# EAGLE design sensorboard (EAGLE 9.6.2)

## Sheet 1 of 2
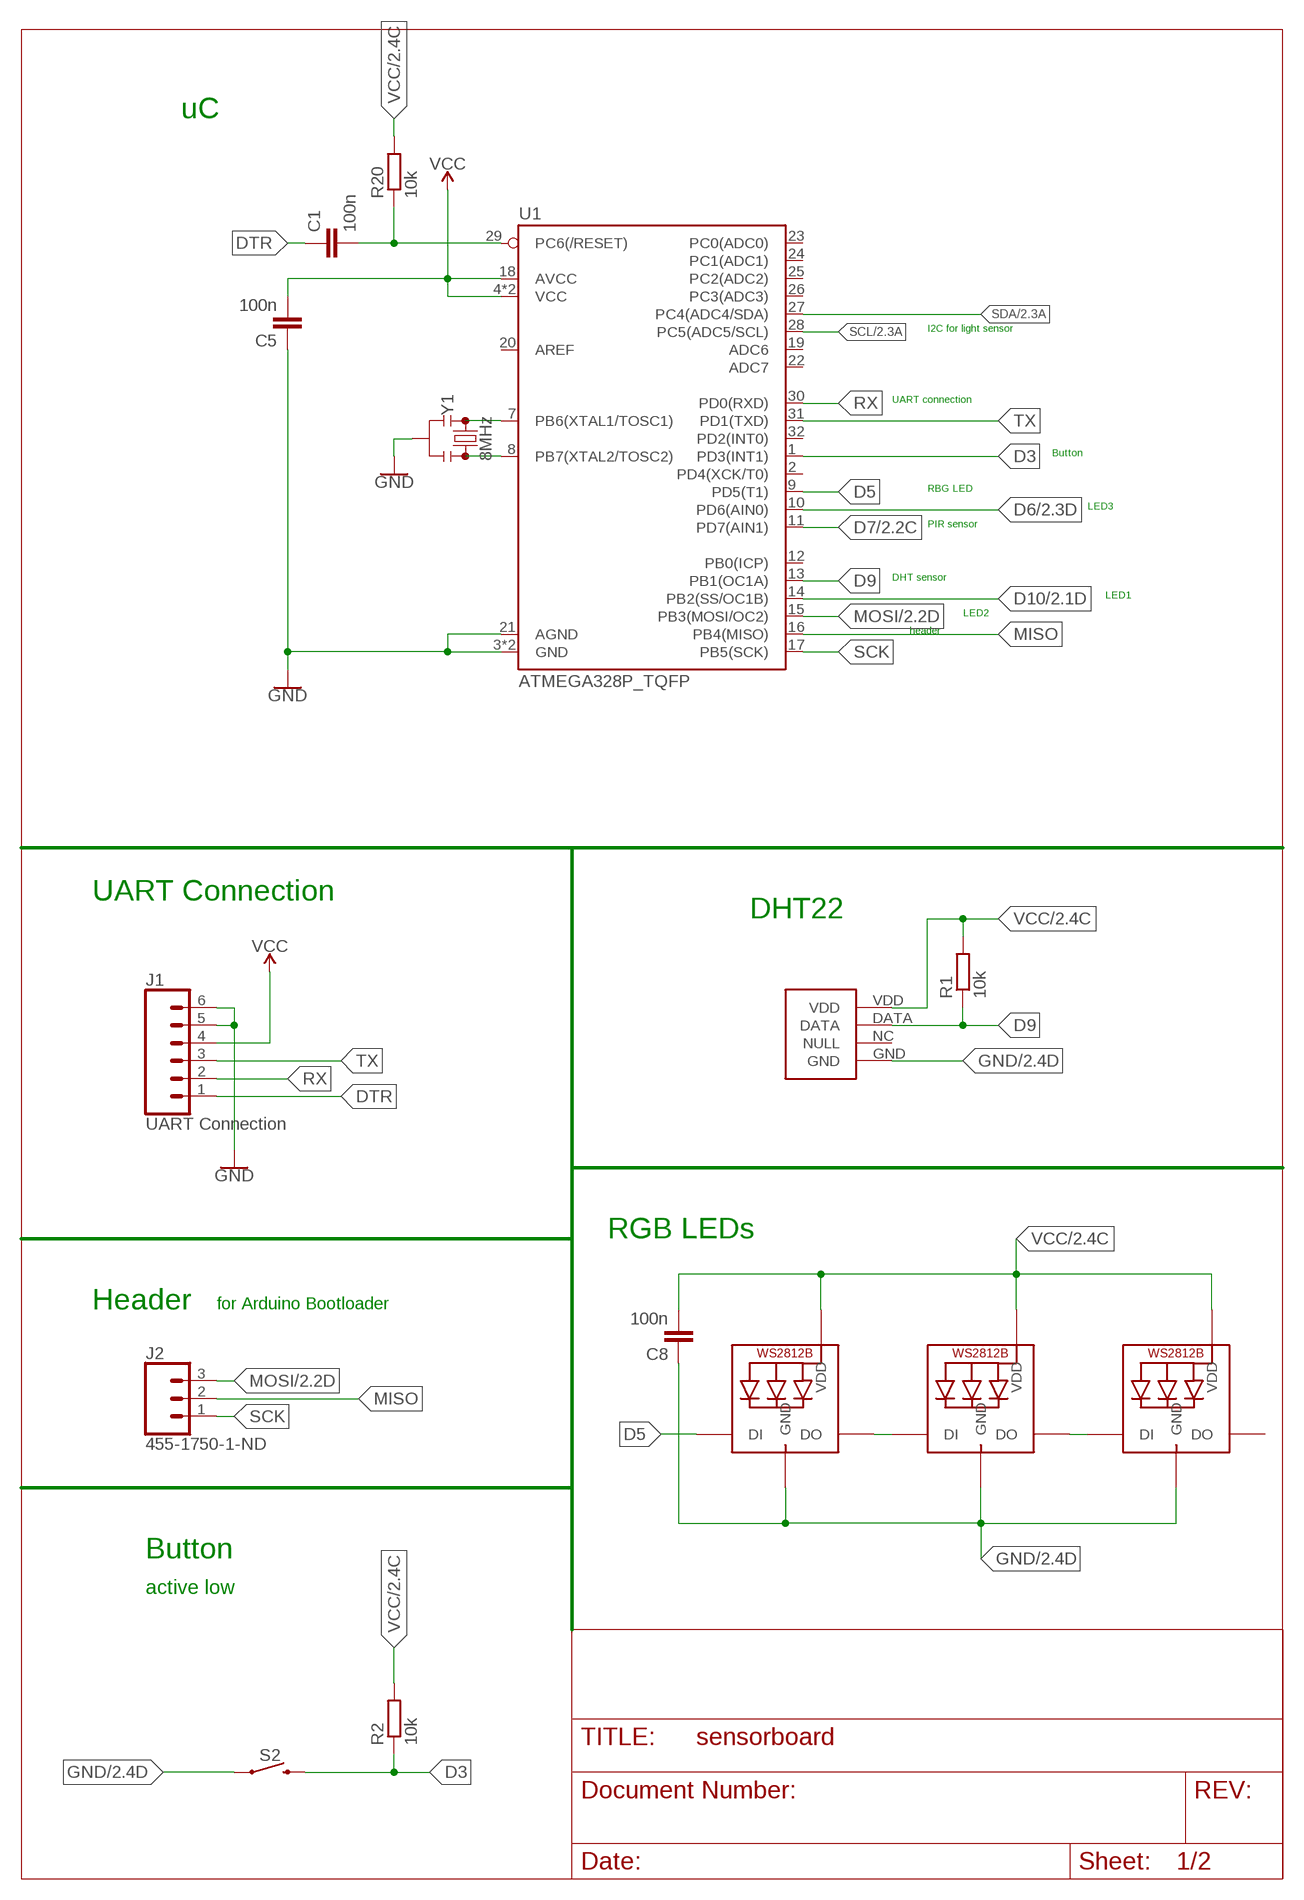
[diagram p0: schematic, sheet 1]

### Parts
C1  100n  C-EUC0402  [C0402]
C5  100n  C-EUC0402  [C0402]
C8  100n  C-EUC0402  [C0402]
DHT22  DHT22  [DHT22]
J1  UART Connection  CONN_06SILK_FEMALE_PTH  [1X06]
J2  455-1750-1-ND  CONN_03  [1X03]
LED1  WS2812B5050  [WS2812B]
LED2  WS2812B5050  [WS2812B]
LED3  WS2812B5050  [WS2812B]
R1  10k  R-EU_R0402  [R0402]
R2  10k  R-EU_R0402  [R0402]
R20  10k  R-EU_R0402  [R0402]
S2  MOMENTARY-SWITCH-SPST-SMD-6.0X3.5MM  [TACTILE_SWITCH_SMD_6.0X3.5MM]
U1  ATMEGA328P_TQFP  [TQFP32-08]
Y1  8MHz  RESONATOR-8MHZSMD_3.2X1.3  [RESONATOR-SMD-3.2X1.3]

### Nets
D3: R2.1 S2.2 U1.1(PD3(INT1))
D5: LED2.4-DIN(DI) U1.9(PD5(T1))
D6: U1.10(PD6(AIN0)) ; also sheet 2
D7: U1.11(PD7(AIN1)) ; also sheet 2
D9: DHT22.DATA R1.1 U1.13(PB1(OC1A))
D10: U1.14(PB2(SS/OC1B)) ; also sheet 2
DTR: C1.1 J1.1
GND: C5.1 C8.1 DHT22.GND J1.5 J1.6 LED1.3-GND(GND) LED2.3-GND(GND) LED3.3-GND(GND) S2.1 U1.3(GND) U1.5(GND) U1.21(AGND) Y1.2 ; also sheet 2
MISO: J2.2 U1.16(PB4(MISO))
MOSI: J2.3 U1.15(PB3(MOSI/OC2)) ; also sheet 2
N$1: U1.7(PB6(XTAL1/TOSC1)) Y1.1
N$2: U1.8(PB7(XTAL2/TOSC2)) Y1.3
N$4: LED1.4-DIN(DI) LED2.2-DOUT(DO)
N$9: LED1.2-DOUT(DO) LED3.4-DIN(DI)
N$10: C1.2 R20.1 U1.29(PC6(/RESET))
RX: J1.2 U1.30(PD0(RXD))
SCK: J2.1 U1.17(PB5(SCK))
SCL: U1.28(PC5(ADC5/SCL)) ; also sheet 2
SDA: U1.27(PC4(ADC4/SDA)) ; also sheet 2
TX: J1.3 U1.31(PD1(TXD))
VCC: C5.2 C8.2 DHT22.VDD J1.4 LED1.1-VDD(VDD) LED2.1-VDD(VDD) LED3.1-VDD(VDD) R1.2 R2.2 R20.2 U1.4(VCC) U1.6(VCC) U1.18(AVCC) ; also sheet 2
Unconnected: DHT22.NC(NULL) LED3.2-DOUT(DO) U1.2(PD4(XCK/T0)) U1.12(PB0(ICP)) U1.19(ADC6) U1.20(AREF) U1.22(ADC7) U1.23(PC0(ADC0)) U1.24(PC1(ADC1)) U1.25(PC2(ADC2)) U1.26(PC3(ADC3)) U1.32(PD2(INT0))

### Notes on the sheet
- uC
- I2C for light sensor
- UART connection
- Button
- RBG LED
- LED3
- PIR sensor
- DHT sensor
- LED1
- LED2
- header
- UART Connection
- DHT22
- RGB LEDs
- Header | for Arduino Bootloader
- Button
- active low

## Sheet 2 of 2
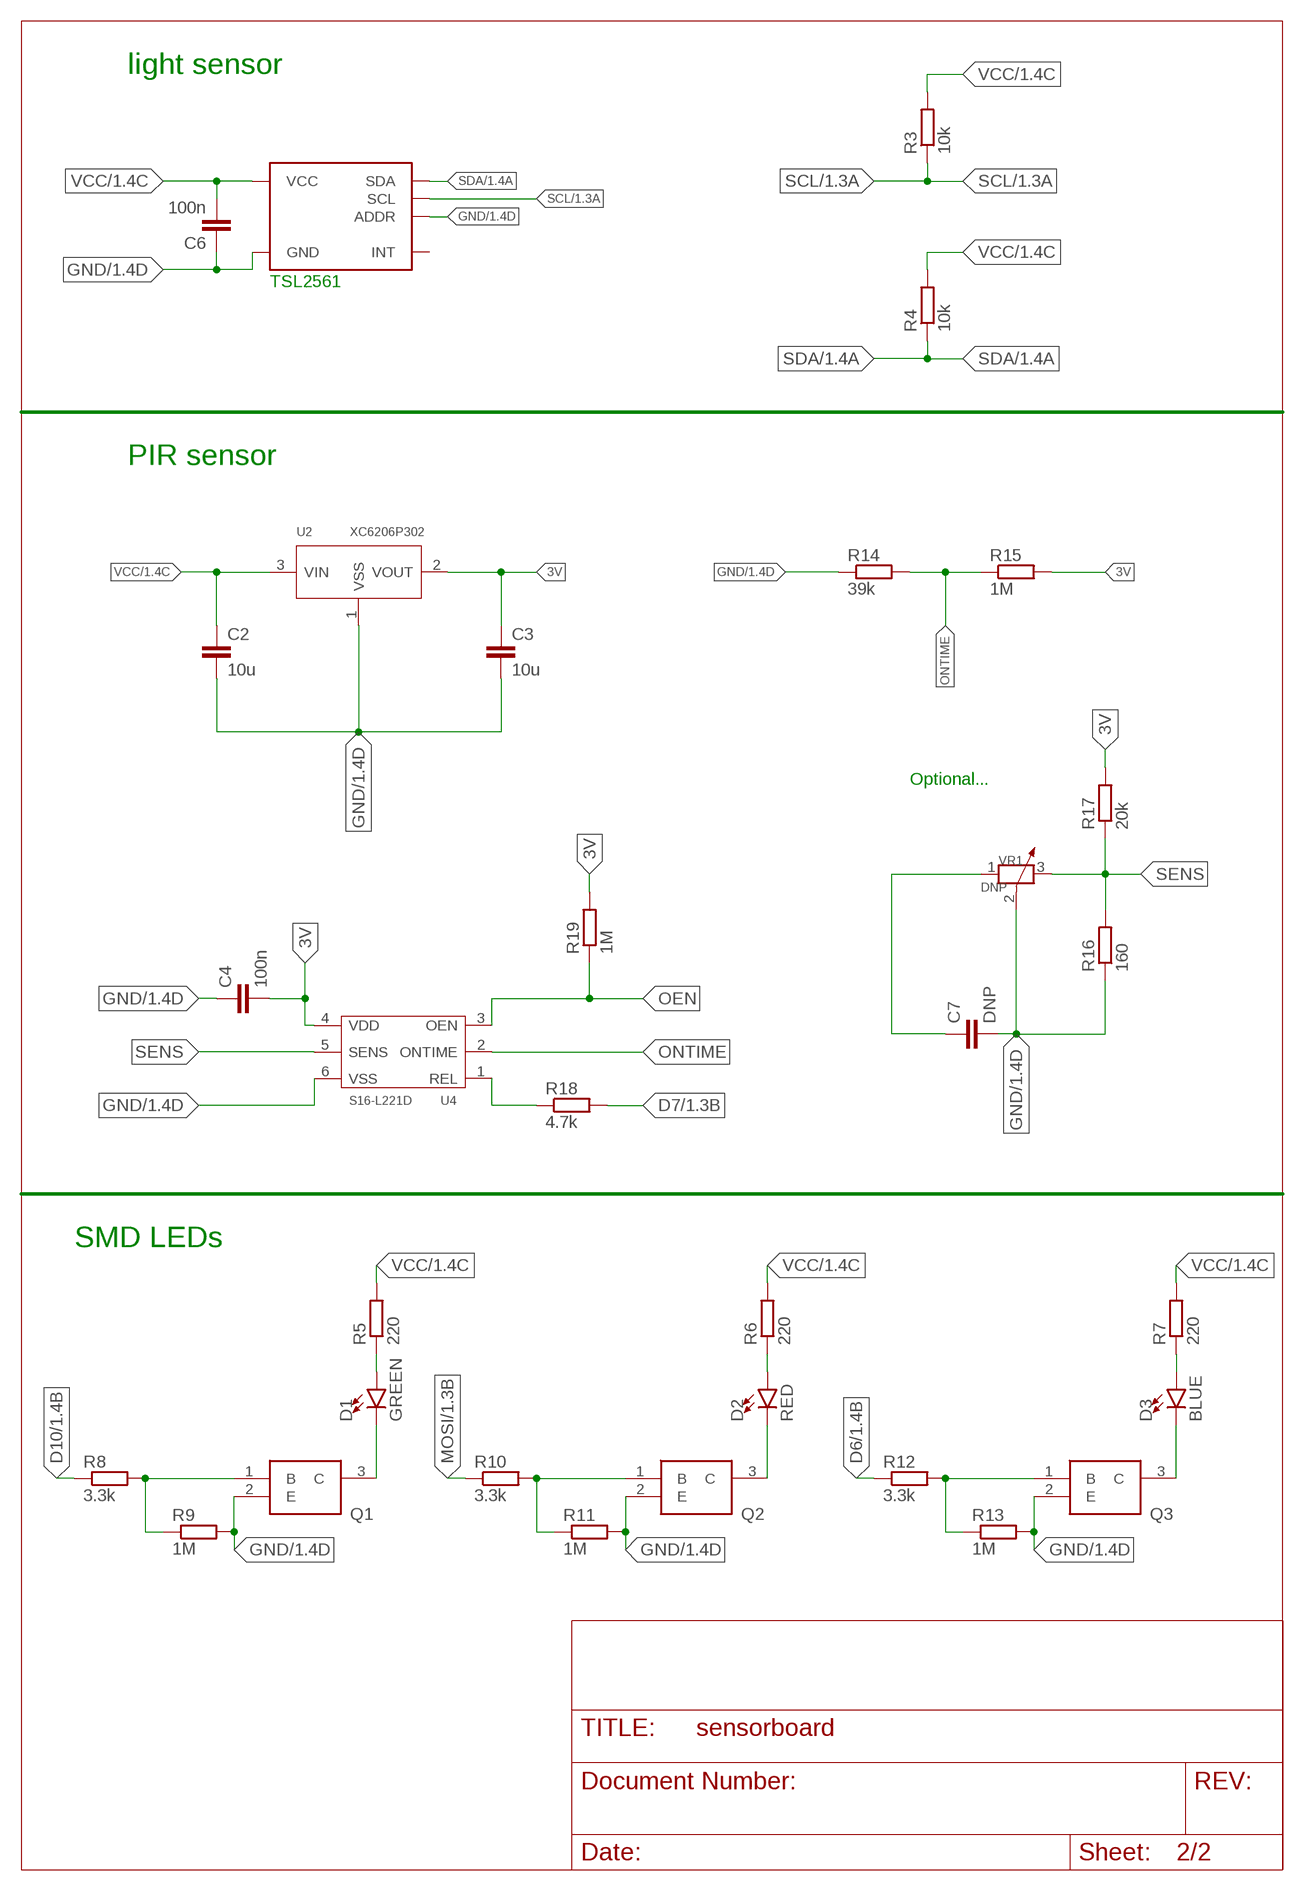
[diagram p1: schematic, sheet 2]

### Parts
C2  10u  C-EUC0402  [C0402]
C3  10u  C-EUC0402  [C0402]
C4  100n  C-EUC0402  [C0402]
C6  100n  C-EUC0402  [C0402]
C7  DNP  C-EUC0402  [C0402]
D1  GREEN  LED-GREEN0603  [LED-0603]
D2  RED  LED-RED0603  [LED-0603]
D3  BLUE  LED-BLUE0603  [LED-0603]
Q1  MMSS8050-L-TP  [SOT96P237X122-3N]
Q2  MMSS8050-L-TP  [SOT96P237X122-3N]
Q3  MMSS8050-L-TP  [SOT96P237X122-3N]
R3  10k  R-EU_R0402  [R0402]
R4  10k  R-EU_R0402  [R0402]
R5  220  R-EU_R0402  [R0402]
R6  220  R-EU_R0402  [R0402]
R7  220  R-EU_R0402  [R0402]
R8  3.3k  R-EU_R0402  [R0402]
R9  1M  R-EU_R0402  [R0402]
R10  3.3k  R-EU_R0402  [R0402]
R11  1M  R-EU_R0402  [R0402]
R12  3.3k  R-EU_R0402  [R0402]
R13  1M  R-EU_R0402  [R0402]
R14  39k  R-EU_R0402  [R0402]
R15  1M  R-EU_R0402  [R0402]
R16  160  R-EU_R0402  [R0402]
R17  20k  R-EU_R0402  [R0402]
R18  4.7k  R-EU_R0402  [R0402]
R19  1M  R-EU_R0402  [R0402]
TSL2561  TSL2561FN  [DFN-6]
U2  XC6206P302  PMIC-XC6206PMR  [SOT-23]
U4  S16-L221D  [6P-SMD-6X6MM]
VR1  DNP  RES-ADJ'RTRIM3214W'  [ADJR3-SMD-4.6X3.7MM]

### Nets
3V: C3.1 C4.2 R15.2 R17.2 R19.2 U2.2(VOUT) U4.4(VDD)
D6: R12.1 ; also sheet 1
D7: R18.2 ; also sheet 1
D10: R8.1 ; also sheet 1
GND: C2.2 C3.2 C4.1 C6.1 C7.2 Q1.2(E) Q2.2(E) Q3.2(E) R9.2 R11.2 R13.2 R14.1 R16.1 TSL2561.ADDR TSL2561.GND U2.1(VSS) U4.6(VSS) VR1.2 ; also sheet 1
MOSI: R10.1 ; also sheet 1
N$3: R18.1 U4.1(REL)
N$7: C7.1 VR1.1
N$8: D1.C Q1.3(C)
N$11: Q1.1(B) R8.2 R9.1
N$12: Q2.1(B) R10.2 R11.1
N$14: Q3.1(B) R12.2 R13.1
N$17: D1.A R5.1
N$22: D2.C Q2.3(C)
N$23: D2.A R6.1
N$25: D3.A R7.1
N$26: D3.C Q3.3(C)
OEN: R19.1 U4.3(OEN)
ONTIME: R14.2 R15.1 U4.2(ONTIME)
SCL: R3.1 TSL2561.SCL ; also sheet 1
SDA: R4.1 TSL2561.SDA ; also sheet 1
SENS: R16.2 R17.1 U4.5(SENS) VR1.3
VCC: C2.1 C6.2 R3.2 R4.2 R5.2 R6.2 R7.2 TSL2561.VDD(VCC) U2.3(VIN) ; also sheet 1
Unconnected: TSL2561.INT

### Notes on the sheet
- light sensor
- TSL2561
- PIR sensor
- Optional...
- SMD LEDs

## Library data of the parts
C1-C8 = rcl:C-EU: CAPACITOR, European symbol; SPICEPREFIX: C
D1 = SparkFun-LED:LED-GREEN: Green SMD LED Used in manufacturing of various products at SparkFun Packages: 0603 - SMD 0603 package [Product Link] <http://www.futureelectronics.com/en/technologies/semiconductors/optoelectronics/leds/Pages/9894312-LTST-C190GKT.aspx?CrossPart=HSMG-C190&IM=0> LilyPad 1206 - SMD1206 LilyPad package [Product Link] <http://www.futureelectronics.com/en/Technologies/Product.aspx?ProductID=IN150NGHARVATEKCORPORATION2049943&IM=0> 1206 - SMD1206 package [Product Link] <http://www.futureelectronics.com/en/technologies/semiconductors/optoelectronics/leds/Pages/8315665-LTST-C150KGKT.aspx?IM=0> 1206 Bottom Mount -SMD 1206 Bottom Mount [Product Link] <http://www.digikey.com/product-detail/en/lite-on-inc/LTST-C230KGKT/160-1456-1-ND/386854> SparkFun Products: Pro Mini 328 -5V <https://www.sparkfun.com/products/821> RedBoard <https://www.sparkfun.com/products/12757> MP3 Trigger <https://www.sparkfun.com/products/13720> Makey Makey <https://www.sparkfun.com/products/11076>; PROD_ID: DIO-00821
D2 = SparkFun-LED:LED-RED: Red SMD LED Used in manufacturing of most products at SparkFun Packages: 0603 - SMD 0603 package [Product Link] <http://docs.avagotech.com/docs/AV02-0551EN> 0603 SMART - SMD 0603 SMART package ( more efficient and expensive)[Product Link] <http://www.osram-os.com/Graphics/XPic2/00077099_0.pdf> 1206 - SMD1206 package [Product Link] <https://www.sparkfun.com/datasheets/DevTools/LilyPad/Q150OVS4.pdff> SparkFun Products: Pro Mini 328 -5V <https://www.sparkfun.com/products/821> RedBoard <https://www.sparkfun.com/products/12757> IOIO-OTG <https://www.sparkfun.com/products/13613>; PROD_ID: DIO-00819
D3 = SparkFun-LED:LED-BLUE: Blue SMD LED Used in manufacturing of various products at SparkFun Packages: 0603 - SMD 0603 package [Product Link] <http://www.digikey.com/product-detail/en/SMLE12BC7TT86/511-1589-2-ND/1641808> 1206 - SMD1206 package [Product Link] <http://www.digikey.com/product-detail/en/lite-on-inc/LTST-C150TBKT/160-1643-1-ND/573584> SparkFun Products: ESP8266 Thing-Dev Board <https://www.sparkfun.com/products/13711> RedBoard <https://www.sparkfun.com/products/12757>; PROD_ID: DIO-08575
DHT22 = DHT22:DHT22
J1 = SparkFun-Connectors:CONN_06: Multi connection point. Often used as Generic Header-pin footprint for 0.1 inch spaced/style header connections On any of the 0.1 inch spaced packages, you can populate with these: Break Away Headers - Straight <https://www.sparkfun.com/products/116> (PRT-00116) Break Away Male Headers - Right Angle <https://www.sparkfun.com/products/553> (PRT-00553) Female Headers <https://www.sparkfun.com/products/115> (PRT-00115) Break Away Headers - Machine Pin <https://www.sparkfun.com/products/117> (PRT-00117) Break Away Female Headers - Swiss Machine Pin <https://www.sparkfun.com/products/743> (PRT-00743) Arduino Stackable Header - 6 Pin <https://www.sparkfun.com/products/9280> (PRT-09280) For SCREWTERMINALS and SPRING TERMINALS visit here: Screw Terimnals on SparkFun.com <https://www.sparkfun.com/search/results?term=Screw+Terminals> (5mm/3.5mm/2.54mm spacing) This device is also useful as a general connection point to wire up your design to another part of your project. Our various solder wires solder well into these plated through hole pads. Hook-Up Wire - Assortment (Stranded, 22 AWG) <https://www.sparkfun.com/products/11375> (PRT-11375) Hook-Up Wire - Assortment (Solid Core, 22 AWG) <https://www.sparkfun.com/products/11367> (PRT-11367) View the entire wire category on our website here <https://www.sparkfun.com/categories/141>; PROD_ID: CONN-08437
J2 = SparkFun-Connectors:CONN_03: Multi connection point. Often used as Generic Header-pin footprint for 0.1 inch spaced/style header connections On any of the 0.1 inch spaced packages, you can populate with these: Break Away Headers - Straight <https://www.sparkfun.com/products/116> (PRT-00116) Break Away Male Headers - Right Angle <https://www.sparkfun.com/products/553> (PRT-00553) Female Headers <https://www.sparkfun.com/products/115> (PRT-00115) Break Away Headers - Machine Pin <https://www.sparkfun.com/products/117> (PRT-00117) Break Away Female Headers - Swiss Machine Pin <https://www.sparkfun.com/products/743> (PRT-00743) Stackable Header - 3 Pin (Female, 0.1") <https://www.sparkfun.com/products/13875> (PRT-13875) For SCREWTERMINALS and SPRING TERMINALS visit here: Screw Terimnals on SparkFun.com <https://www.sparkfun.com/search/results?term=Screw+Terminals> (5mm/3.5mm/2.54mm spacing) This device is also useful as a general connection point to wire up your design to another part of your project. Our various solder wires solder well into these plated through hole pads. Hook-Up Wire - Assortment (Stranded, 22 AWG) <https://www.sparkfun.com/products/11375> (PRT-11375) Hook-Up Wire - Assortment (Solid Core, 22 AWG) <https://www.sparkfun.com/products/11367> (PRT-11367) View the entire wire category on our website here <https://www.sparkfun.com/categories/141> Special notes: Molex polarized connector foot print use with SKU : PRT-08232 with associated crimp pins and housings.; PROD_ID: XXX-00000
LED1-LED3 = WS2812B:WS2812B; AVAILABILITY: Unavailable; DESCRIPTION: Raspberry Pi HAT (40 pin) Wheeled Robotics Kit; MF: Seeed Technology; MP: WS2812B; PACKAGE: None; PRICE: None
Q1-Q3 = SamacSys_Parts:MMSS8050-L-TP: Bipolar Transistors - BJT 625mW, 25V, 1500mA Source: Datasheet <https://componentsearchengine.com/Datasheets/1/MMSS8050-L-TP.pdf>; DESCRIPTION: Bipolar Transistors - BJT 625mW, 25V, 1500mA; HEIGHT: 1.22mm; MANUFACTURER_NAME: Micro Commercial Components (MCC); MANUFACTURER_PART_NUMBER: MMSS8050-L-TP; MOUSER_PART_NUMBER: 833-MMSS8050-L-TP; MOUSER_PRICE-STOCK: https://www.mouser.co.uk/ProductDetail/Micro-Commercial-Components-MCC/MMSS8050-L-TP?qs=FaVZESsvgnebflbaqJWJVQ%3D%3D
R1-R20 = rcl:R-EU_: RESISTOR, European symbol; SPICEPREFIX: R
S2 = SparkFun-Switches:MOMENTARY-SWITCH-SPST: Momentary Switch (Pushbutton) - SPST Normally-open (NO) SPST momentary switches (buttons, pushbuttons). Variants PTH-12MM - 12mm square, through-hole Momentary Pushbutton Switch - 12mm Square <https://www.sparkfun.com/products/9190> (COM-09190) PTH-6.0MM, PTH-6.0MM-KIT - 6.0mm square, through-hole Mini Pushbutton Switch <https://www.sparkfun.com/products/97> (COM-00097) KIT package intended for soldering kit's - only one side of pads' copper is exposed. PTH-RIGHT-ANGLE-KIT - Right-angle, through-hole Right Angle Tactile Button <https://www.sparkfun.com/products/10791> - Used on SparkFun BigTime Watch Kit <https://www.sparkfun.com/products/11734> SMD-12MM - 12mm square, surface-mount Tactile Button - SMD (12mm) <https://www.sparkfun.com/products/12993> (COM-12993) Used on SparkFun PicoBoard <https://www.sparkfun.com/products/11888> SMD-4.5MM - 4.5mm Square Trackball Switch Used on SparkFun Blackberry Trackballer Breakout <https://www.sparkfun.com/products/13169> SMD-4.6MMX2.8MM - 4.60mm x 2.80mm, surface mount Used on SparkFun SAMD21 Mini Breakout <https://www.sparkfun.com/products/13664> SMD-5.2MM, SMD-5.2-REDUNDANT - 5.2mm square, surface-mount Mini Pushbutton Switch - SMD <https://www.sparkfun.com/products/8720> (COM-08720) Used on Arduino Pro Mini <https://www.sparkfun.com/products/11114> REDUNDANT package connects both switch circuits together SMD-6.0X3.5MM - 6.0 x 3.5mm, surface mount Momentary Reset Switch SMD <https://www.sparkfun.com/products/8229> (COM-08229) SMD-6.2MM-TALL - 6.2mm square, surface mount Tactile Button - SMD (6mm) <https://www.sparkfun.com/products/12992> Used on SparkFun Digital Sandbox <https://www.sparkfun.com/products/12651> SMD-RIGHT-ANGLE - Right-angle, surface mount Used on SparkFun Block for Intel® Edison - Arduino <https://www.sparkfun.com/products/13036>; PROD_ID: SWCH-14278; SF_SKU: COM-08229
TSL2561 = TSL2561:TSL2561: Check prices <https://pricing.snapeda.com/parts/TSL2561/ams/view-part?ref=eda>; AVAILABILITY: Bad; DESCRIPTION: Optical Sensor Ambient 640nm I²C 6-SMD, No Lead; MF: ams; MP: TSL2561; PACKAGE: SMD-6 TAOS; PRICE: None
U1 = SparkFun-IC-Microcontroller:ATMEGA328P_TQFP: Popular 328P in QFP Storefront component: ATmega328 - TQFP <https://www.sparkfun.com/products/13448> (COM-13448) Datasheet <http://www.sparkfun.com/datasheets/Components/SMD/ATMega328.pdf> SparkFun Products SparkFun RedBoard - Programmed with Arduino <https://www.sparkfun.com/products/12757> (DEV-12757) Arduino Pro Mini 328 - 5V/16MHz <https://www.sparkfun.com/products/11113> (DEV-11113) Arduino Pro Mini 328 - 3.3V/8MHz <https://www.sparkfun.com/products/11114> (DEV-11114) SparkFun OpenLog <https://www.sparkfun.com/products/13712> (DEV-13712) SparkFun MicroView - OLED Arduino Module <https://www.sparkfun.com/products/12923> (DEV-12923) SparkFun Digital Sandbox <https://www.sparkfun.com/products/12651> (DEV-12651) SparkFun PicoBoard <https://www.sparkfun.com/products/11888> (WIG-11888) Arduino Fio <https://www.sparkfun.com/products/10116> (DEV-10116) LilyPad Arduino 328 Main Board <https://www.sparkfun.com/products/13342> (DEV-13342) SparkFun RedStick <https://www.sparkfun.com/products/13741> (DEV-13741) LilyPad MP3 <https://www.sparkfun.com/products/11013> (DEV-11013) LilyPad Arduino SimpleSnap <https://www.sparkfun.com/products/10941> (DEV-10941) SparkFun Stepoko <https://www.sparkfun.com/products/13899> (ROB-13899) SparkFun Geiger Counter <https://www.sparkfun.com/products/11345> (SEN-11345) SparkFun EL Sequencer <https://www.sparkfun.com/products/12781> (COM-12781) Arduino Pro 328 - 5V/16MHz <https://www.sparkfun.com/products/10915> (DEV-10915) CryptoCape <https://www.sparkfun.com/products/12773> (DEV-12773) SparkFun IR Thermometer Evaluation Board - MLX90614 <https://www.sparkfun.com/products/10740> (SEN-10740) SparkFun RedBot Mainboard <https://www.sparkfun.com/products/12097> (ROB-12097) Arduino Pro 328 - 3.3V/8MHz <https://www.sparkfun.com/products/10914> (DEV-10914) SparkFun Block for Intel® Edison - Arduino <https://www.sparkfun.com/products/13036> (DEV-13036) SparkFun Simon Says - Surface Mount Soldering Kit <https://www.sparkfun.com/products/10935> (KIT-10935) SparkFun 7-Segment Serial Display - Red <https://www.sparkfun.com/products/11441> (COM-11441) SparkFun 7-Segment Serial Display - White <https://www.sparkfun.com/products/11629> (COM-11629) SparkFun 7-Segment Serial Display - Yellow <https://www.sparkfun.com/products/11443> (COM-11443) SparkFun 7-Segment Serial Display - Kelly Green <https://www.sparkfun.com/products/11440> (COM-11440) SparkFun 7-Segment Serial Display - Blue <https://www.sparkfun.com/products/11442> (COM-11442) SparkFun OpenSegment Serial Display - 20mm (Blue) <https://www.sparkfun.com/products/11647> (COM-11647) SparkFun OpenSegment Serial Display - 20mm (Green) <https://www.sparkfun.com/products/11646> (COM-11646) SparkFun OpenSegment Serial Display - 20mm (White) <https://www.sparkfun.com/products/11648> (COM-11648) SparkFun OpenSegment Serial Display - 20mm (Red) <https://www.sparkfun.com/products/11644> (COM-11644) SparkFun OpenSegment Serial Display - 20mm (Yellow) <https://www.sparkfun.com/products/11645> (COM-11645) SparkFun OpenSegment Shield <https://www.sparkfun.com/products/13190> (DEV-13190); PROD_ID: IC-09069
U2 = IC-new:PMIC-XC6206P: LOW ESR Cap.Compatible Positive Voltage Regulators
U4 = template:S16-L221D
VR1 = Discrete-new:RES-ADJ: Potentiometer
Y1 = SparkFun-Clocks:RESONATOR-8MHZ: 8MHz Resonator Digikey Example <http://www.digikey.com/product-detail/en/murata-electronics-north-america/CSTCE10M0G55-R0/490-1196-1-ND/584633> Frequency: 8MHz Frequency Stability: ±0.2% Frequency Tolerance: ±0.5% Capacitance: 33pF SparkFun Products Arduino Pro Mini 328- 3.3V/8MHz <https://www.sparkfun.com/products/11114> SparkFun Digital Sandbox <https://www.sparkfun.com/products/12651>; PROD_ID: XTAL-08895

## Board
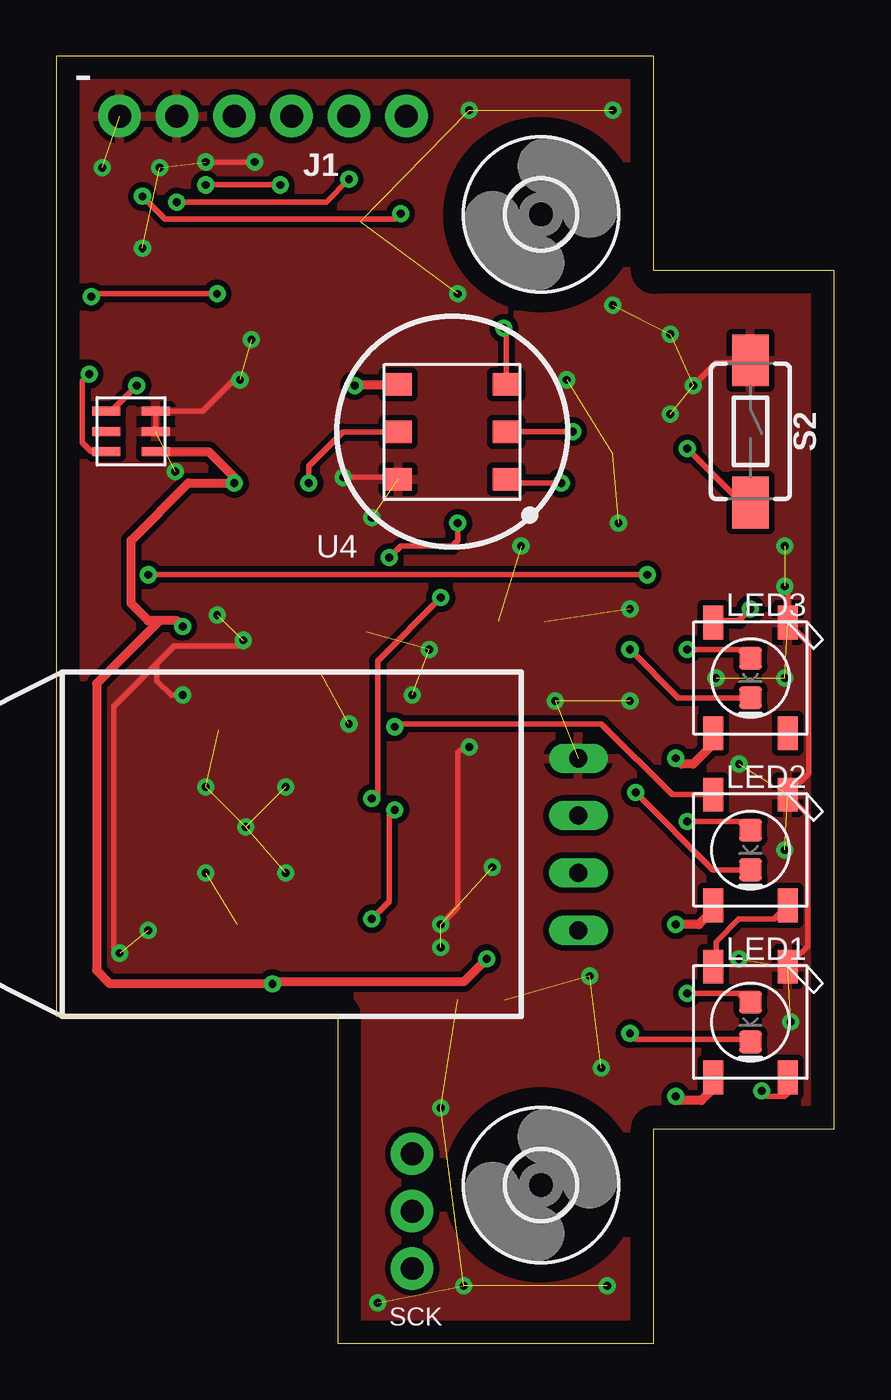
[diagram p2: board, top side]
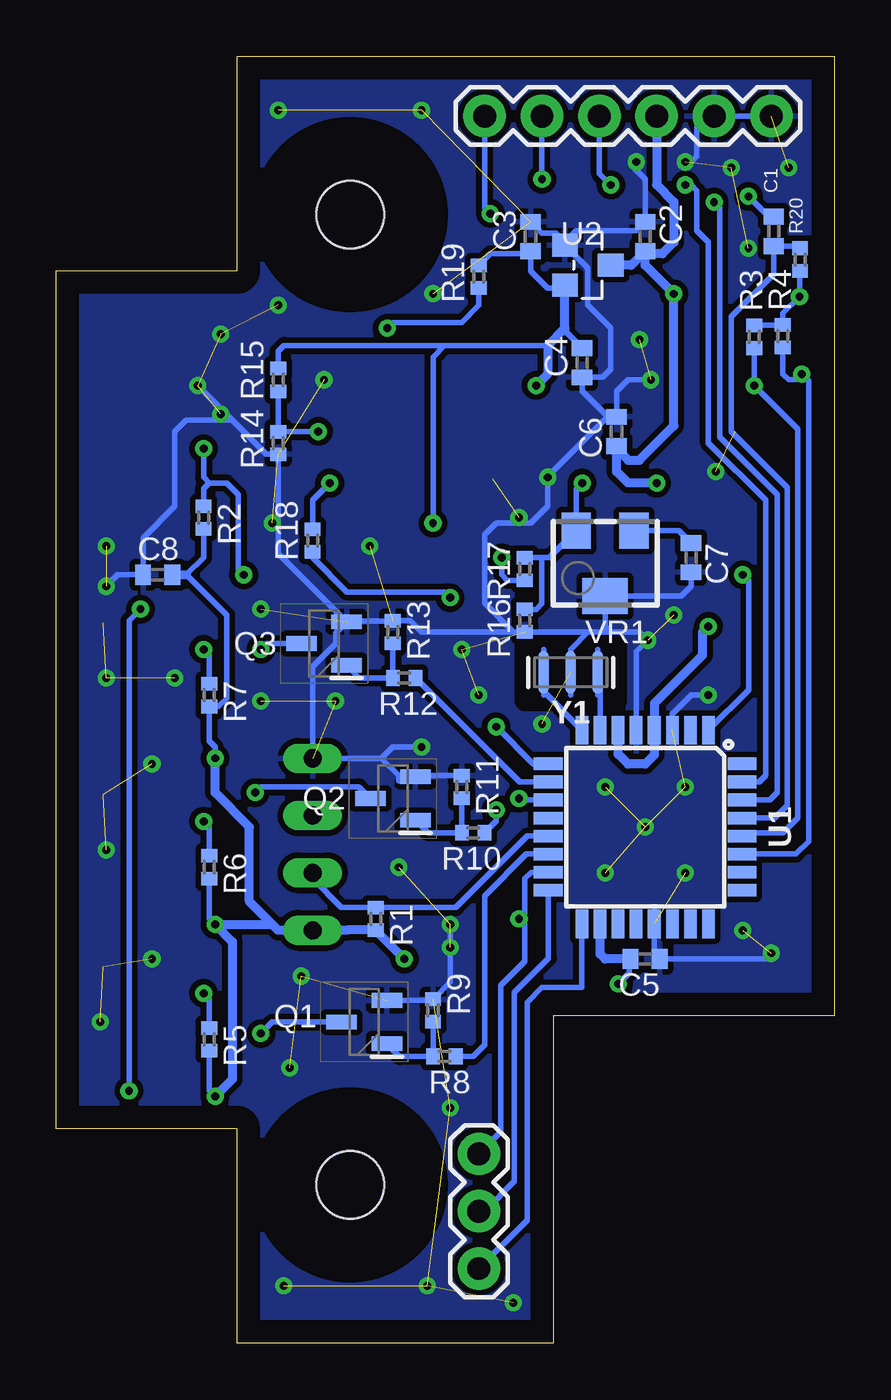
[diagram p3: board, bottom side, seen from below]

Size 34.46 x 57 mm. Coordinates in mm from the lower left corner, seen from the top.
Outline: 12.46,14.5 12.46,0 26.46,0 26.46,9.5 34.46,9.5 34.46,47.5 26.46,47.5 26.46,57 0,57 0,14.5 12.46,14.5
Copper layers (1*16): Top 0.035mm / dielectric 1.5mm / Bottom 0.035mm
Design rules "default *": minimum track width 6mil, minimum drill 0.35mm, track to track 6mil, track to pad 6mil, pad to pad 6mil, via to via 6mil, smd to smd 6mil, copper to edge 40mil, drill to drill 6mil, minimum pad ring 10mil, minimum via ring 8mil, stop-mask expansion 4mil, vias tented up to drill 0mil, thermal gap 10mil
bRestrict: area 9.7,28.4 to 13.7,31

### Footprints (pad centres in the part's own frame; a part is rotated, then mirrored left to right if it is on the bottom)
C0402 = smd 0.7 x 0.9: 1 -0.65,0; 2 0.65,0
LED-0603 = smd 1 x 1: A -0.877,0; C 0.877,0
DHT22 = drill 0.8 long: DATA -1.27,0; GND 3.81,0; NC 1.27,0; VDD -3.81,0
1X06 = drill 1.016 pad 1.88: 1 0,0; 2 2.54,0; 3 5.08,0; 4 7.62,0; 5 10.16,0; 6 12.7,0
1X03 = drill 1.016 pad 1.88: 1 0,0; 2 2.54,0; 3 5.08,0
WS2812B = smd 1.5 x 0.9: 1-VDD 2.45,-1.65; 2-DOUT 2.45,1.65; 3-GND -2.45,1.65; 4-DIN -2.45,-1.65
SOT96P237X122-3N = smd 1.35 x 0.65: 1 -1,0.96; 2 -1,-0.96; 3 1,0
R0402 = smd 0.6 x 0.7: 1 -0.5,0; 2 0.5,0
TACTILE_SWITCH_SMD_6.0X3.5MM = smd 2.3 x 1.6: 1 -3.15,0; 2 3.15,0
DFN-6 = smd 1.25 x 0.4: ADDR -1.1,0; GND -1.1,-0.9; INT 1.1,0; SCL 1.1,-0.9; SDA 1.1,0.9; VDD -1.1,0.9
TQFP32-08 = smd 1.27 x 0.559: 1 -4.293,2.8; 2 -4.293,2; 3 -4.293,1.2; 4 -4.293,0.4; 5 -4.293,-0.4; 6 -4.293,-1.2; 7 -4.293,-2; 8 -4.293,-2.8; 17 4.293,-2.8; 18 4.293,-2; 19 4.293,-1.2; 20 4.293,-0.4; 21 4.293,0.4; 22 4.293,1.2; 23 4.293,2; 24 4.293,2.8 | smd 0.559 x 1.27: 9 -2.8,-4.293; 10 -2,-4.293; 11 -1.2,-4.293; 12 -0.4,-4.293; 13 0.4,-4.293; 14 1.2,-4.293; 15 2,-4.293; 16 2.8,-4.293; 25 2.8,4.293; 26 2,4.293; 27 1.2,4.293; 28 0.4,4.293; 29 -0.4,4.293; 30 -1.2,4.293; 31 -2,4.293; 32 -2.8,4.293
SOT-23 = smd 1.016 x 1.143: 1 -0.889,-1.016; 2 0.889,-1.016; 3 0,1.016
6P-SMD-6X6MM = smd 1.2 x 1: 1 -2.4,2.1; 2 -2.4,0; 3 -2.4,-2.1; 4 2.4,-2.1; 5 2.4,0; 6 2.4,2.1
3,0 = hole 3: 0,0
ADJR3-SMD-4.6X3.7MM = smd 1.3 x 1.6: 1 -1.275,-1.45; 3 1.275,-1.45 | smd 2 x 1.6: 2 0,1.45
RESONATOR-SMD-3.2X1.3 = smd 0.45 x 1.905: 1 -1.2,0; 2 0,0; 3 1.2,0

### Placement (x,y rotation side)
C1  2.69,49.25 270 bottom
C2  8.38,49.02 90 bottom
C3  13.46,49.02 90 bottom
C4  11.18,43.43 90 bottom
C5  8.38,17.02 180 bottom
C6  9.65,40.39 270 bottom
C7  6.35,34.8 270 bottom
C8  29.97,34.04 0 bottom
D1  30.73,14.22 270 top
D2  30.73,21.84 270 top
D3  30.73,29.46 270 top
DHT22  23.11,22.1 90 top
J1  15.49,54.36 0 bottom
J2  15.75,3.3 90 bottom
LED1  30.73,14.22 270 top
LED2  30.73,21.84 270 top
LED3  30.73,29.46 270 top
Q1  20.83,14.22 180 bottom
Q2  19.56,24.13 180 bottom
Q3  22.61,30.99 180 bottom
R1  20.32,18.8 270 bottom
R2  27.94,36.58 270 bottom
R3  3.56,44.58 90 bottom
R4  2.29,44.6 90 bottom
R5  27.69,13.46 270 bottom
R6  27.69,21.08 270 bottom
R7  27.69,28.7 270 bottom
R8  17.27,12.7 180 bottom
R9  17.78,14.73 90 bottom
R10  16,22.61 180 bottom
R11  16.51,24.64 90 bottom
R12  19.05,29.46 180 bottom
R13  19.56,31.5 90 bottom
R14  24.64,39.88 90 bottom
R15  24.64,42.67 90 bottom
R16  13.72,32 90 bottom
R17  13.72,34.29 270 bottom
R18  23.11,35.56 270 bottom
R19  15.75,47.24 90 bottom
R20  1.52,48.01 270 bottom
S2  30.73,40.39 270 top
TSL2561  3.3,40.39 180 top
U1  8.38,22.86 270 bottom
U2  10.92,47.75 270 bottom
U4  17.53,40.37 180 top
U$1  [3,0]  21.46,50 0 top
U$2  [3,0]  21.46,7 0 top
VR1  10.16,34.54 180 bottom
Y1  11.68,29.72 180 bottom

### Tracks (layer width: path | path; a pad name or v marks a point on that pad's centre or on a via)
3V  (via drill 0.35)
  Top 0.254: v14.73,34.8 15.24,35.31 17.53,35.31 17.78,35.56 v17.78,36.32
  Top 0.406: v13.21,42.42 13.26,42.47 U4.4
  Bottom 0.254: 12.07,46.74 12.7,46.74 13.46,47.5 C3.1 13.58,48.25 15.24,48.25 R19.2 | 12.07,46.74 U2.2 | C4.2 11.94,44.85 | 11.94,46.61 12.07,46.74 | R17.2 14.49,33.79 14.73,34.04 v14.73,34.8 | R15.2 24.64,43.94 24.38,44.2 17.27,44.2 | 17.27,44.2 12.7,44.2 | v17.78,36.32 17.78,43.69 17.27,44.2
  Bottom 0.406: 11.94,44.85 11.94,44.96 | 11.94,44.96 11.94,46.61 | 11.94,44.96 12.7,44.2 12.7,42.93 v13.21,42.42
D3  (via drill 0.35)
  Top 0.254: S2.2 30.33,37.24 v27.94,39.62 | v26.16,34.04 v4.06,34.04
  Bottom 0.254: U1.1 3.8,28.93 3.8,33.78 v4.06,34.04 | v26.16,34.04 26.42,34.29 26.42,37.59 26.92,38.1 27.69,38.1 | 27.69,38.1 27.94,37.85 R2.1 | v27.94,39.62 27.94,38.35 27.69,38.1
D5  (via drill 0.35)
  Top 0.254: LED2.4-DIN 27.27,24.29 24.13,27.43 15.11,27.43 v14.99,27.3
  Bottom 0.254: v14.99,27.3 13.34,25.66 U1.9
D6
  Bottom 0.254: R12.1 13.95,24.86 U1.10
D7  (via drill 0.35)
  Top 0.254: v13.97,24.13 14.22,24.13 14.22,30.23 v17.02,33.02
  Bottom 0.254: R18.2 23.11,34.8 21.59,33.27 17.27,33.27 v17.02,33.02 | v13.97,24.13 13.97,24.06 U1.11
D9
  Bottom 0.254: DHT22.DATA 23.11,20.57 21.84,19.3 R1.1 16.77,19.3 13.61,22.46 U1.13
D10
  Bottom 0.254: R8.1 16,12.7 15.49,13.21 15.49,19.81 13.65,21.66 U1.14
DTR  (via drill 0.35)
  Top 0.254: v15.24,50.04 14.99,49.78 4.83,49.78 v3.81,50.8
  Bottom 0.254: v15.24,50.04 15.49,50.29 J1.1 | C1.1 2.91,49.9 v3.81,50.8
GND  (via drill 0.35)  (43 unrouted)
  Top 0.254: TSL2561.ADDR TSL2561.GND 6.49,41.29 7.87,42.67 v8.13,42.67 | S2.1 30.63,43.43 29.21,43.43 v28.19,42.42 | LED1.3-GND 33.27,17.56 33.27,23.4 LED2.3-GND 33.31,25.22 33.31,30.98 LED3.3-GND 32.38,33.4 v32.26,33.53 | v17.02,18.54 17.78,19.3 17.78,26.16 18.03,26.42 v18.29,26.42 | v2.79,17.27 2.54,17.53 2.54,28.19 4.45,30.1 | v8.27,31.13 8.02,30.88 5.23,30.88 4.45,30.1 | v5.59,28.7 5.08,28.7 4.45,29.34 4.45,30.1 | v6.6,52.32 v8.79,52.32 | U4.6 15.04,38.35 v12.7,38.35
  Bottom 0.254: U1.21 7.98,17.27 C5.1 3.05,17.02 v2.79,17.27 | Q1.2 17.83,15.18 R9.2 17.02,15.99 v17.02,18.54 | R11.2 18.51,25.14 Q2.2 18.76,24.89 19.3,24.89 19.3,25.15 20.07,25.91 | Q3.2 21.56,32 R13.2 18.8,32 18.3,31.5 14.22,31.5 | 9.91,31.5 8.64,31.5 v8.27,31.13 8.78,30.63 8.78,29.64 | 9.91,31.5 10.92,31.5 11.68,30.73 Y1.2 | 10.03,31.62 10.16,31.75 VR1.2 6.78,33.09 6.35,33.53 C7.2 | 10.03,31.62 9.91,31.5 | 11.94,48.77 U2.1 10.92,47.62 10.92,45.97 9.91,44.96 9.91,43.15 10.27,42.78 C4.1 11.18,42.16 10.05,41.04 | C3.2 12.95,49.16 12.33,49.16 11.94,48.77 | 10.05,41.04 C6.1 9.65,42.16 9.14,42.67 v8.13,42.67 | 10.03,31.62 10.15,31.5 R16.1 14.22,31.5 | v28.19,42.42 26.67,40.89 | 26.67,40.89 25.15,39.38 R14.1 24.64,34.98 Q3.2 | 26.67,40.89 28.7,40.89 29.21,40.39 29.21,37.08 30.62,35.67 C8.1 31.75,34.04 v32.26,33.53 | 20.07,25.91 DHT22.GND 23.11,29.97 22.1,30.99 22.1,31.46 Q3.2 | 20.07,25.91 19.56,26.42 v18.29,26.42 | 8.79,29.64 8.78,29.64 | U1.5 8.78,29.64 | U1.3 7.18,27.87 6.35,28.7 v5.59,28.7 | J1.6 J1.5 5.59,54.36 6.1,53.85 6.1,52.58 6.35,52.32 v6.6,52.32 | v8.79,52.32 8.89,52.22 8.89,52.07 8.38,51.56 C2.2 8.78,49.28 11.43,49.28 11.94,48.77 | 10.05,41.04 12.73,38.35 | v12.7,38.35 12.73,38.35 | 12.73,38.35 12.7,38.32 12.7,37.08 13.46,36.32 14.99,36.32 15.49,35.81 15.49,32.77 14.22,31.5
  other vias: 6.6,20.83 6.6,24.64 10.16,24.64 10.16,20.83 4.06,18.29 8.64,44.45 18.29,54.61 24.64,54.61 17.78,46.48 24.64,45.97 27.18,44.7 27.18,41.15 32.26,35.31 32.26,29.46 32.51,14.22 30.23,17.02 32.26,21.84 30.23,25.65 29.21,29.46 25.4,32.51 24.89,36.32 22.61,42.67 20.57,35.31 13.97,36.58 16.51,30.73 7.11,32.26 12.95,27.43 15.75,28.7 17.02,17.53 23.62,16.26 24.13,12.19 17.02,10.41 18.03,2.54 24.38,2.54 14.22,1.78 19.3,21.08 22.1,28.45 25.4,28.45 3.81,48.51 2.03,52.07 4.57,52.07 5.26,38.61 8.38,22.86
  pour Bottom (isolate 0.254): 0,56.9 26.42,56.9 26.42,47.5 34.54,47.5 34.54,9.4 26.42,9.4 26.42,0 12.45,0 12.45,14.48 0,14.48
  pour Top (isolate 0.254): 0,57.15 26.42,57.15 26.42,47.5 34.54,47.5 34.54,9.4 26.42,9.4 26.42,0 12.45,0 12.45,14.48 0,14.48
MISO
  Bottom 0.254: J2.2 15.49,5.84 14.17,7.16 14.17,15.54 12.68,17.04 U1.16
MOSI  (via drill 0.35)
  Top 0.254: v14.99,23.62 14.73,23.37 14.73,19.56 v13.97,18.8
  Bottom 0.254: J2.3 14.78,9.35 14.78,15.84 13.72,16.91 13.72,18.54 v13.97,18.8 13.72,19.05 13.72,20.57 13.43,20.86 U1.15 | R10.1 14.99,23.12 v14.99,23.62
N$1
  Bottom 0.254: Y1.1 10.38,29.62 U1.7
N$2
  Bottom 0.254: Y1.3 12.88,28.86 U1.8
N$3  (via drill 0.35)
  Top 0.254: v22.35,38.1 20.09,38.1 U4.1
  Bottom 0.254: R18.1 23.11,37.34 v22.35,38.1
N$4
  Top 0.254: LED1.4-DIN 29.21,16.8 29.21,17.78 30.23,18.8 31.79,18.8 LED2.2-DOUT
N$7
  Bottom 0.254: C7.1 6.9,35.99 VR1.1
N$8  (via drill 0.35)
  Top 0.254: D1.C 30.62,13.46 25.65,13.46 v25.4,13.72
  Bottom 0.254: Q1.3 24.89,14.22 v25.4,13.72
N$9  (via drill 0.35)
  Top 0.254: LED1.2-DOUT 32.38,11.05 32.26,10.92 31.5,10.92 v31.24,11.18 | v30.73,32.51 30.23,32 29.17,32 LED3.4-DIN
  Bottom 0.254: v31.24,11.18 31.24,32 v30.73,32.51
N$10
  Bottom 0.254: U1.29 2.65,23.26 2.08,23.82 2.08,37.9 4.57,40.39 4.57,45.47 2.69,47.34 C1.2 1.62,48.6 R20.1
N$11
  Bottom 0.254: R9.1 17.78,12.71 R8.2 19.26,12.7 Q1.1
N$12
  Bottom 0.254: Q2.1 17.99,22.61 16.51,22.61 | R10.2 16.51,22.61 | R11.1 16.51,22.61
N$14
  Bottom 0.254: R13.1 19.56,29.47 R12.2 21.04,29.46 Q3.1
N$17  (via drill 0.35)
  Top 0.254: D1.A 30.62,15.1 30.23,15.49 v27.94,15.49
  Bottom 0.254: v27.94,15.49 27.69,15.24 R5.1
N$22  (via drill 0.35)
  Top 0.254: D2.C 29.07,20.97 v25.65,24.38
  Bottom 0.254: v25.65,24.38 25.4,24.64 21.07,24.64 Q2.3
N$23  (via drill 0.35)
  Top 0.254: D2.A 30.62,22.72 30.23,23.11 v27.94,23.11
  Bottom 0.254: v27.94,23.11 27.69,22.86 R6.1
N$25  (via drill 0.35)
  Top 0.254: D3.A 30.62,30.34 30.23,30.73 v27.94,30.73
  Bottom 0.254: v27.94,30.73 27.69,30.48 R7.1
N$26  (via drill 0.35)
  Top 0.254: D3.C 27.55,28.59 v25.4,30.73
  Bottom 0.254: v25.4,30.73 25.15,30.99 Q3.3
OEN  (via drill 0.35)
  Top 0.254: v19.81,44.96 19.93,44.84 U4.3
  Bottom 0.254: R19.1 15.75,45.97 16.51,45.21 19.56,45.21 v19.81,44.96
ONTIME  (via drill 0.35)
  Top 0.254: U4.2 19.94,40.39 v22.86,40.39
  Bottom 0.254: R15.1 R14.2 22.86,40.38 v22.86,40.39
RX  (via drill 0.35)
  Top 0.254: v12.95,51.56 11.94,50.55 v5.33,50.55
  Bottom 0.254: U1.30 2.86,24.06 2.54,24.38 2.54,37.59 5.08,40.13 5.08,50.29 v5.33,50.55 | v12.95,51.56 J1.2
SCK
  Bottom 0.254: U1.17 11.18,15.75 12.95,15.75 13.61,15.09 13.61,5.44 J2.1
SCL  (via drill 0.35)
  Top 0.254: v3.56,42.42 2.42,41.29 TSL2561.SCL
  Bottom 0.254: U1.28 3.94,22.61 2.29,22.61 1.63,23.27 1.63,40.49 v3.56,42.42 R3.1
SDA  (via drill 0.35)
  Top 0.254: TSL2561.SDA 1.54,39.49 1.14,39.88 1.14,42.62 v1.45,42.93
  Bottom 0.254: U1.27 1.71,21.66 1.14,22.23 1.14,42.62 v1.45,42.93 1.7,42.67 2.03,42.67 2.29,42.93 R4.1
SENS  (via drill 0.35)
  Top 0.254: v11.18,38.1 11.18,38.86 12.68,40.37 U4.5
  Bottom 0.254: 12.95,34.79 12.64,34.79 VR1.3 11.43,37.84 v11.18,38.1 | 12.95,34.79 R17.1 | R16.2 13.22,32.5 12.95,32.77 12.95,34.79
TX  (via drill 0.35)
  Top 0.254: v6.6,51.31 v9.91,51.31
  Bottom 0.254: U1.31 3.33,24.86 3.05,25.14 3.05,37.34 5.59,39.88 5.59,48.77 6.1,49.28 6.1,51.05 6.35,51.31 v6.6,51.31 | v9.91,51.31 10.41,51.82 J1.3
VCC  (via drill 0.35)
  Top 0.254: v1.55,46.35 1.68,46.48 v7.11,46.48
  Top 0.406: TSL2561.VDD 6.74,39.49 7.87,38.35 | 7.87,38.35 8,38.23 v7.87,38.1 | 7.87,38.35 v7.87,38.1 | LED2.1-VDD 29.08,19.18 28.45,18.54 v27.43,18.54 | LED3.1-VDD 29.08,26.54 28.19,25.65 27.69,25.65 v27.43,25.91 | LED1.1-VDD 29.08,11.34 29.12,11.3 28.56,10.74 27.61,10.74 v27.43,10.92 | v19.05,17.02 18.03,16 9.65,16 v9.57,15.92 2.37,15.92 1.78,16.51 1.78,29.21 4.57,32 | v5.59,31.75 5.33,32 4.57,32 | 4.57,32 4.06,32 3.3,32.77 3.3,35.56 5.84,38.1 v7.87,38.1
  Bottom 0.254: C5.2 9.09,17.07 9.09,16.4 v9.57,15.92 | 8.27,48.26 C2.1 | v27.43,18.54 27.69,18.8 R6.2 | v27.43,25.91 27.43,26.42 27.69,26.67 R7.2 27.28,28.2 26.92,28.56 26.92,32.26 28.7,34.04 27.94,34.8 R2.2 | R5.2 27.69,11.18 v27.43,10.92 | R3.2 3.53,45.1 R4.2 2.29,45.62 v1.55,46.35 1.55,47.48 R20.2
  Bottom 0.406: U2.3 9,47.75 C2.1 8.38,47.75 v7.11,46.48 7.11,40.64 8.64,39.12 9.14,39.12 9.65,39.62 C6.2 9.65,38.61 9.14,38.1 v7.87,38.1 | J1.4 7.87,51.31 7.11,50.55 7.11,48.77 7.62,48.26 8.27,48.26 | C8.2 28.7,34.04 | 24.89,18.54 25.91,19.56 25.91,22.86 27.43,24.38 v27.43,25.91 | v27.43,10.92 26.67,11.68 26.67,17.78 v27.43,18.54 24.89,18.54 | v19.05,17.02 20.32,18.29 R1.2 21.58,18.3 21.59,18.29 DHT22.VDD 24.64,18.29 24.89,18.54 | v5.59,31.75 5.84,31.5 5.84,30.48 7.98,28.34 7.98,27.92 U1.4 7.98,26.05 8.38,25.65 9.14,25.65 9.58,26.09 U1.6 | C5.2 10.16,17.02 10.38,17.24 U1.18

### Text on the board
tNames: - | SCK